# Altium project bluetooth_clock.PrjPcb
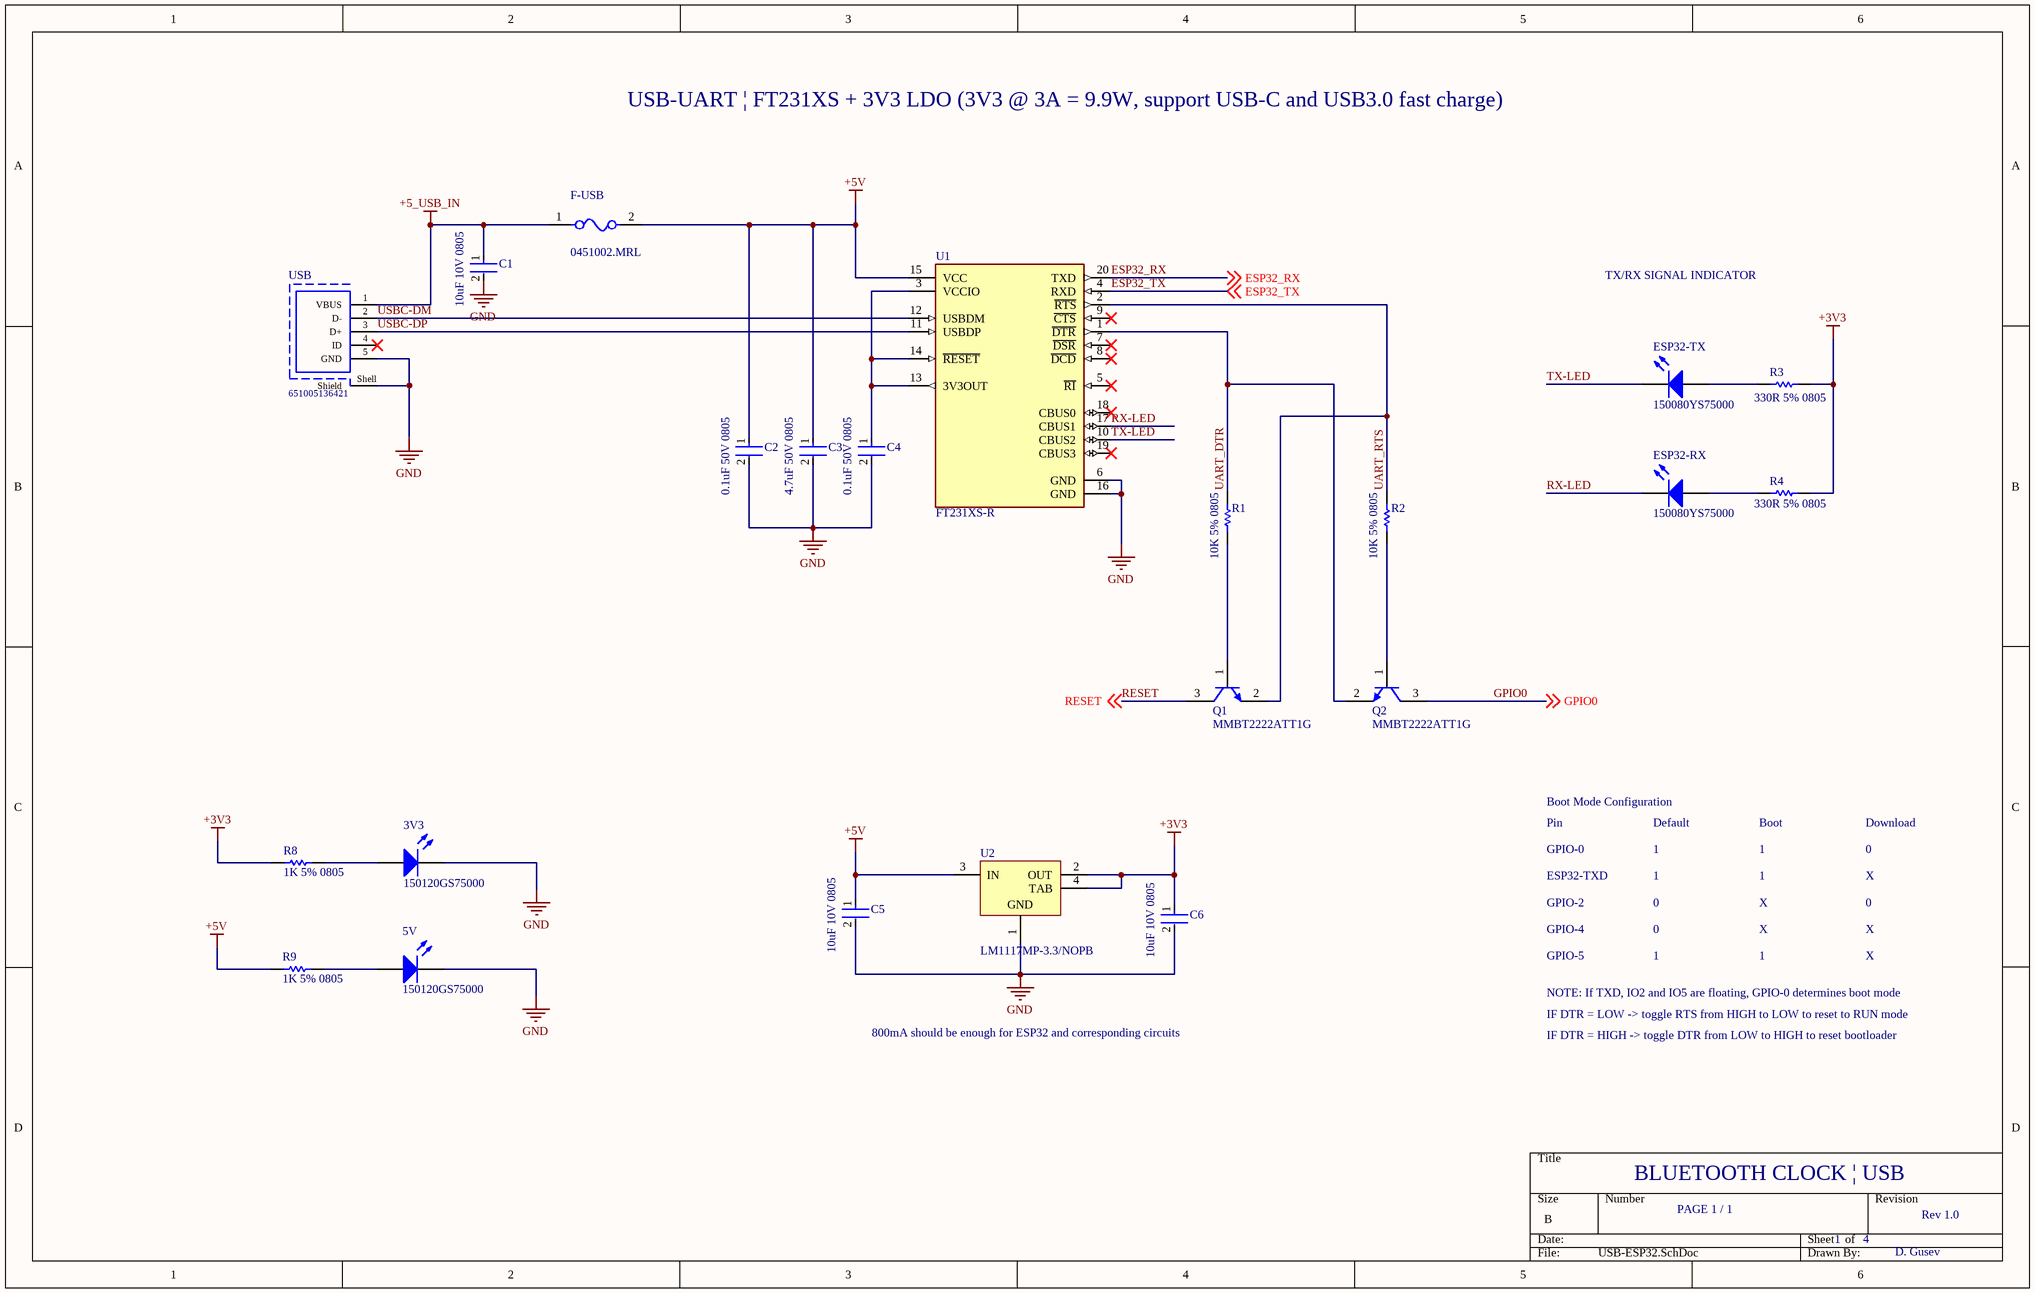
[diagram p0: USB-ESP32.SchDoc]
4 sheets, 56 parts. Net scope: global (net labels, ports and power ports of the same name join across sheets).
Board file: bluetooth_clock.PcbDoc
Sheets:
  USB-ESP32.SchDoc
  ESP32.SchDoc
  audio.SchDoc
  sd_card.SchDoc

## Sheet USB-ESP32.SchDoc
size B

### Parts
3V3  150120GS75000  [1206_A]
5V  150120GS75000  [1206_A]
C1  10uF 10V 0805  [FP-C0805C-DG-MFG]
C2  0.1uF 50V 0805  [FP-C0805C-DN-MFG]
C3  4.7uF 50V 0805  [FP-C2012-125-MFG]
C4  0.1uF 50V 0805  [FP-C0805C-DN-MFG]
C5  10uF 10V 0805  [FP-C0805C-DG-MFG]
C6  10uF 10V 0805  [FP-C0805C-DG-MFG]
ESP32-RX  150080YS75000  [0805_A]
ESP32-TX  150080YS75000  [0805_A]
F-USB  0451002.MRL  [FP-0451-MFG]
Q1  MMBT2222ATT1G  [ONSC-SC-75-3-463-01_V]
Q2  MMBT2222ATT1G  [ONSC-SC-75-3-463-01_V]
R1  10K 5% 0805  [RESC2013X60X40ML20T25]
R2  10K 5% 0805  [RESC2013X60X40ML20T25]
R3  330R 5% 0805  [RESC2013X60X40ML20T25]
R4  330R 5% 0805  [RESC2013X60X40ML20T25]
R8  1K 5% 0805  [RESC2013X60X40ML20T25]
R9  1K 5% 0805  [RESC2013X60X40ML20T25]
U1  FT231XS-R  [FP-SSOP-20-MFG]
U2  LM1117MP-3.3/NOPB  [DCY0004A_L]
USB  651005136421  [651005136421]

### Nets
+3V3: C6.1 R3.1 R4.1 R8.2 U2.2(OUT) U2.4(TAB)
+5_USB_IN: C1.1 F-USB.1 USB.1(VBUS)
+5V: C2.1 C3.1 C5.1 F-USB.2 R9.2 U1.15(VCC) U2.3(IN)
GND: 3V3.1(K) 5V.1(K) C1.2 C2.2 C3.2 C4.2 C5.2 C6.2 U1.6(GND) U1.16(GND) U2.1(GND) USB.5(GND) USB.Shell(Shield)
ESP32_RX: U1.20(TXD) ; off-sheet ESP32_RX
ESP32_TX: U1.4(RXD) ; off-sheet ESP32_TX
GPIO0: Q2.3(C) ; off-sheet GPIO0
RESET: Q1.3(C) ; off-sheet RESET
RX-LED: ESP32-RX.1(K) U1.17(CBUS1)
TX-LED: ESP32-TX.1(K) U1.10(CBUS2)
UART_DTR: Q2.2(E) R1.2 U1.1(~{DTR})
UART_RTS: Q1.2(E) R2.2 U1.2(~{RTS})
USBC-DM: U1.12(USBDM) USB.2(D-)
USBC-DP: U1.11(USBDP) USB.3(D+)
Net3V3_2: 3V3.2(A) R8.1
Net5V_2: 5V.2(A) R9.1
NetC4_1: C4.1 U1.3(VCCIO) U1.13(3V3OUT) U1.14(~{RESET})
NetESP32-RX_2: ESP32-RX.2(A) R4.2
NetESP32-TX_2: ESP32-TX.2(A) R3.2
NetQ1_1: Q1.1(B) R1.1
NetQ2_1: Q2.1(B) R2.1

Not connected (* = marked no-connect by the designer): U1 5(~{RI})* 7(~{DSR})* 8(~{DCD})* 9(~{CTS})* 18(CBUS0)* 19(CBUS3)*; USB 4(ID)*

### Notes on the sheet
- USB-UART | FT231XS + 3V3 LDO (3V3 @ 3A = 9.9W, support USB-C and USB3.0 fast charge)
- TX/RX SIGNAL INDICATOR
- Boot Mode Configuration
- Pin
- Default
- Boot
- Download
- GPIO-0
- ESP32-TXD
- GPIO-2
- 1
- 0
- X
- GPIO-4
- GPIO-5
- 800mA should be enough for ESP32 and corresponding circuits
- NOTE: If TXD, IO2 and IO5 are floating, GPIO-0 determines boot mode
- IF DTR = LOW -> toggle RTS from HIGH to LOW to reset to RUN mode
- IF DTR = HIGH -> toggle DTR from LOW to HIGH to reset bootloader
- BLUETOOTH CLOCK | USB
- PAGE 1 / 1
- 4
- Rev 1.0
- D. Gusev

### Library data of the parts
3V3 5V = CMP-1426-00014-1: SMD mono-color Chip LED, WL-SMCW, Green; Manufacturer: Wuerth Elektronik; PackageReference: 1206_A; PartNumber: 150120GS75000; ComponentLink1Description: Manufacturer URL; ComponentLink2URL: http://katalog.we-online.com/led/datasheet/150120GS75000.pdf; ComponentLink2Description: Datasheet; Color: Green; ComponentLink1URL: http://www.we-online.com
C1 C5 C6 = CMP-2007-03243-2: CAP CER 10UF 10V X5R 0805; Manufacturer Part Number: C0805C106K8PACTU; Manufacturer: Kemet; 3DS Part Number: 220-00001; Tolerance: 10%; Temperature Coefficient: 15%; Material: Ceramic; Device Class L2: Capacitors; Device Class L1: Passive Components; ComponentLink2URL: https://content.kemet.com/datasheets/KEM_C1006_X5R_SMD.pdf; Height: 1.4mm; Lead Free: Yes; Digikey Description: CAP CER 10UF 10V X5R 0805; Octopart: https://octopart.com/c0805c106k8pactu-kemet-98697; Capacitance: 10uF; Value: 10uF; Temperature Range Low: -55°C; Temperature: -55°C to +85°C; Automotive: No; Mouser Description: CAP CER 10UF 10V X5R 0805; Ipc Land Pattern Name: CAPC200125X125; Temperature Range High: +85°C; Voltage: 10V; RoHS: TRUE; Device Class L3: Ceramic Capacitors; ComponentLink2Description: Datasheet; Voltage Rating: 10V; Package: C0805C-DG; Temperature Characteristic: X5R; Category: Cap
C2 C4 = CMP-2007-00279-2: CAP CER 0.1UF 50V X7R 0805; Manufacturer Part Number: C0805C104K5RACTU; Manufacturer: KEMET; Value: 0.10 μF; Tolerance: 0.1; Temperature Coefficient: 30ppm/°C; Material: Ceramic; Device Class L2: Capacitors; Temperature Range Low: -55°C; Voltage Rating: 50 V; Digikey Description: CAP CER 0.1UF 50V X7R 0805; Category: Cap; ComponentLink2Description: Datasheet; Octopart: https://octopart.com/c0805c104k5ractu-kemet-143926; RoHS: TRUE; ComponentLink2URL: https://content.kemet.com/datasheets/KEM_C1003_C0G_SMD.pdf; Temperature Characteristic: X7R; Temperature: -55°C to +125°C; Height: 0.88mm; Temperature Range High: +125°C; Device Class L1: Passive Components; Automotive: No; Lead Free: Yes; Ipc Land Pattern Name: CAPC200125X78; Device Class L3: Ceramic Capacitors; Mouser Description: Cap Ceramic 0.1uF 50V X7R 10% SMD 2.0 x 1.2 mm 125 C Paper T/R; Capacitance: 0.10 μF; Package: C0805C-DN
C3 = CMP-08246-000007-1: CAP CER 4.7UF 50V X5R 0805; Manufacturer Part Number: C2012X5R1H475K125AB; Manufacturer: TDK Corporation; Tolerance: 10%; Temperature Coefficient: 15%; Material: Ceramic; Mouser Description: Multilayer Ceramic Capacitors MLCC - SMD/SMT 0805 4.7uF 50volts X5R 10%; Category: Cap; Temperature Range High: +85°C; Digikey Description: CAP CER 4.7UF 50V X5R 0805; Voltage Rating: 50V; Device Class L1: Passive Components; Temperature Range Low: -55°C; Lead Free: Yes; ComponentLink2Description: Datasheet; Capacitance: 4.7uF; Octopart: https://octopart.com/c2012x5r1h475k125ab-tdk-25947720; Device Class L2: Capacitors; Value: 4.7uF; Temperature: -55°C to +85°C; ComponentLink2URL: https://product.tdk.com/info/en/catalog/datasheets/mlcc_commercial_general_en.pdf; RoHS: TRUE; Height: 1.45mm; Temperature Characteristic: X5R; Package: C2012-125; Device Class L3: Ceramic Capacitors; Automotive: No
ESP32-RX ESP32-TX = CMP-1426-00012-1: SMD mono-color Chip LED, WL-SMCW, Yellow; Manufacturer: Wuerth Elektronik; Color: Yellow; ComponentLink1URL: http://www.we-online.com; PackageReference: 0805_A; ComponentLink2URL: http://katalog.we-online.com/led/datasheet/150080YS75000.pdf; ComponentLink1Description: Manufacturer URL; ComponentLink2Description: Datasheet; PartNumber: 150080YS75000
F-USB = CMP-08605-000053-1: FUSE BOARD MNT 2A 125VAC/VDC SMD; Manufacturer: Littelfuse; Max Fuse Dc Voltage: 125V; Value: 0.0367Ω; Fuse Interrupt Ac Current: 50A; Fuse I2T: 0.53A2Sec; Fuse Blow Speed: Fast; Device Class L2: Fuses; Temperature Range High: +125°C; Category: Fuse; ComponentLink2URL: https://www.littelfuse.com/~/media/electronics/datasheets/fuses/littelfuse_fuse_451_453_datasheet.pdf.pdf; Automotive: No; Temperature Range Low: -55°C; Voltage Rating: 125V; ComponentLink2Description: Datasheet; Temperature: -55°C to +125°C; Device Class L3: unset; Height: 2.94mm; Lead Free: Yes; Resistance: 0.0367Ω; Max Fuse Ac Voltage: 125V; Fuse Interrupt Dc Current: 50A; RoHS: TRUE; Fuse Current: 2A; Digikey Description: FUSE BOARD MNT 2A 125VAC/VDC SMD; Device Class L1: Circuit Protection; Octopart: https://octopart.com/0451002.mrl-littelfuse-566376; Mouser Description: Surface Mount Fuses 125V 2A; Package: 0451; Manufacturer Part Number: 0451002.MRL
Q1 Q2 = CMP-1048-00417-1: General Purpose Transistor, NPN Silicon, 3-Pin SC-75, Pb-Free, Tape and Reel; Manufacturer: On Semiconductor; IC Continuous (A): 0.6; fT Min (MHz): 300; DatasheetVersion: Rev. 5; PackageVersion: Rev. F, 07/2005; ComponentLink1Description: Manufacturer URL; RoHS: TRUE; Packing: Tape and Reel; ComponentLink3URL: http://www.onsemi.com/pub_link/Collateral/463-01.PDF; ComponentLink1URL: http://www.onsemi.com/; ComponentLink3Description: Package Specification; ComponentLink2URL: http://www.onsemi.cn/pub_link/Collateral/MMBT2222ATT1-D.PDF; Mounting Technology: Surface Mount; PartNumber: MMBT2222ATT1G; ComponentLink2Description: Datasheet; Polarity: NPN; PackageReference: SC-75-3-463-01; PackageDescription: 3-Pin Small Outline Transistor, Body 1.6 x 0.8 mm, Pitch 0.5 mm
R1-R4 R8 R9 = CMP-2001-00590-1: Part Number: ERA6AEB123V; Manufacturer: Panasonic
U1 = CMP-0248-00024-3: IC USB SERIAL FULL UART 20SSOP; Operating Supply Voltage: 5V; Operating Supply Current: 8mA; Number of Channels: 1; Min Supply Voltage: 2.97V; Max Supply Voltage: 5.5V; Data Rate: 12Mbps; Height: 0.059inch; Packaging: Tape and Reel; Mount: Surface Mount; Package Quantity: 2000; Radiation Hardening: No; Case/Package: SSOP; Min Operating Temperature: -40°C; Width: 0.157inch; Number of Pins: 20; Weight: 0.016oz; Interface: UART; Max Operating Temperature: 85°C; Length: 8.74mm
U2 = CMP-0062-01638-4: 800mA Low-Dropout Linear Regulator, 4-pin SOT-223, Pb-Free; Manufacturer: Texas Instruments; CompType: LDO IC; PackageTopMarking: XYTT*N05A; High-Reliability: Y; PowerWise: N; ComponentLink1URL: http://www.ti.com/general/docs/lit/getliterature.tsp?genericPartNumber=LM1117-N&fileType=pdf; PinCount: 4; PackageDescription: Molded SOT-223, 6.50 x 3.56 x 1.6mm Body, 4 Lead, 2.3mm Pitch; Code_IPC: SOT223-4; PartNumber: LM1117MP-3.3/NOPB; Code_JEDEC: TO-261-AA; RoHS: Y; PackageReference: DCY0004A; ComponentLink1Description: Datasheet URL
USB = CMP-1502-03248-1: Mini USB 2.0 Type B Receptacle WR-COM, Vertical, THT; Manufacturer: Wurth Elektronik; Rated Current: 1A; Working Voltage: 30VAC; Contact Resistance: 20mOhm; Gender: Receptacle; Part Number: 651005136421; Package Reference: 651005136421; Datasheet URL: https://katalog.we-online.de/em/datasheet/651005136421%282%29.pdf; Publisher: WurthElektronik; Operating Temperature: -40to105degC; Connector Type: MiniUSB2.0TypeB; Packaging: Tray; Mounting Technology: THT; Manufacturer URL: http://www.we-online.de; Orientation: Vertical

## Sheet ESP32.SchDoc
size B
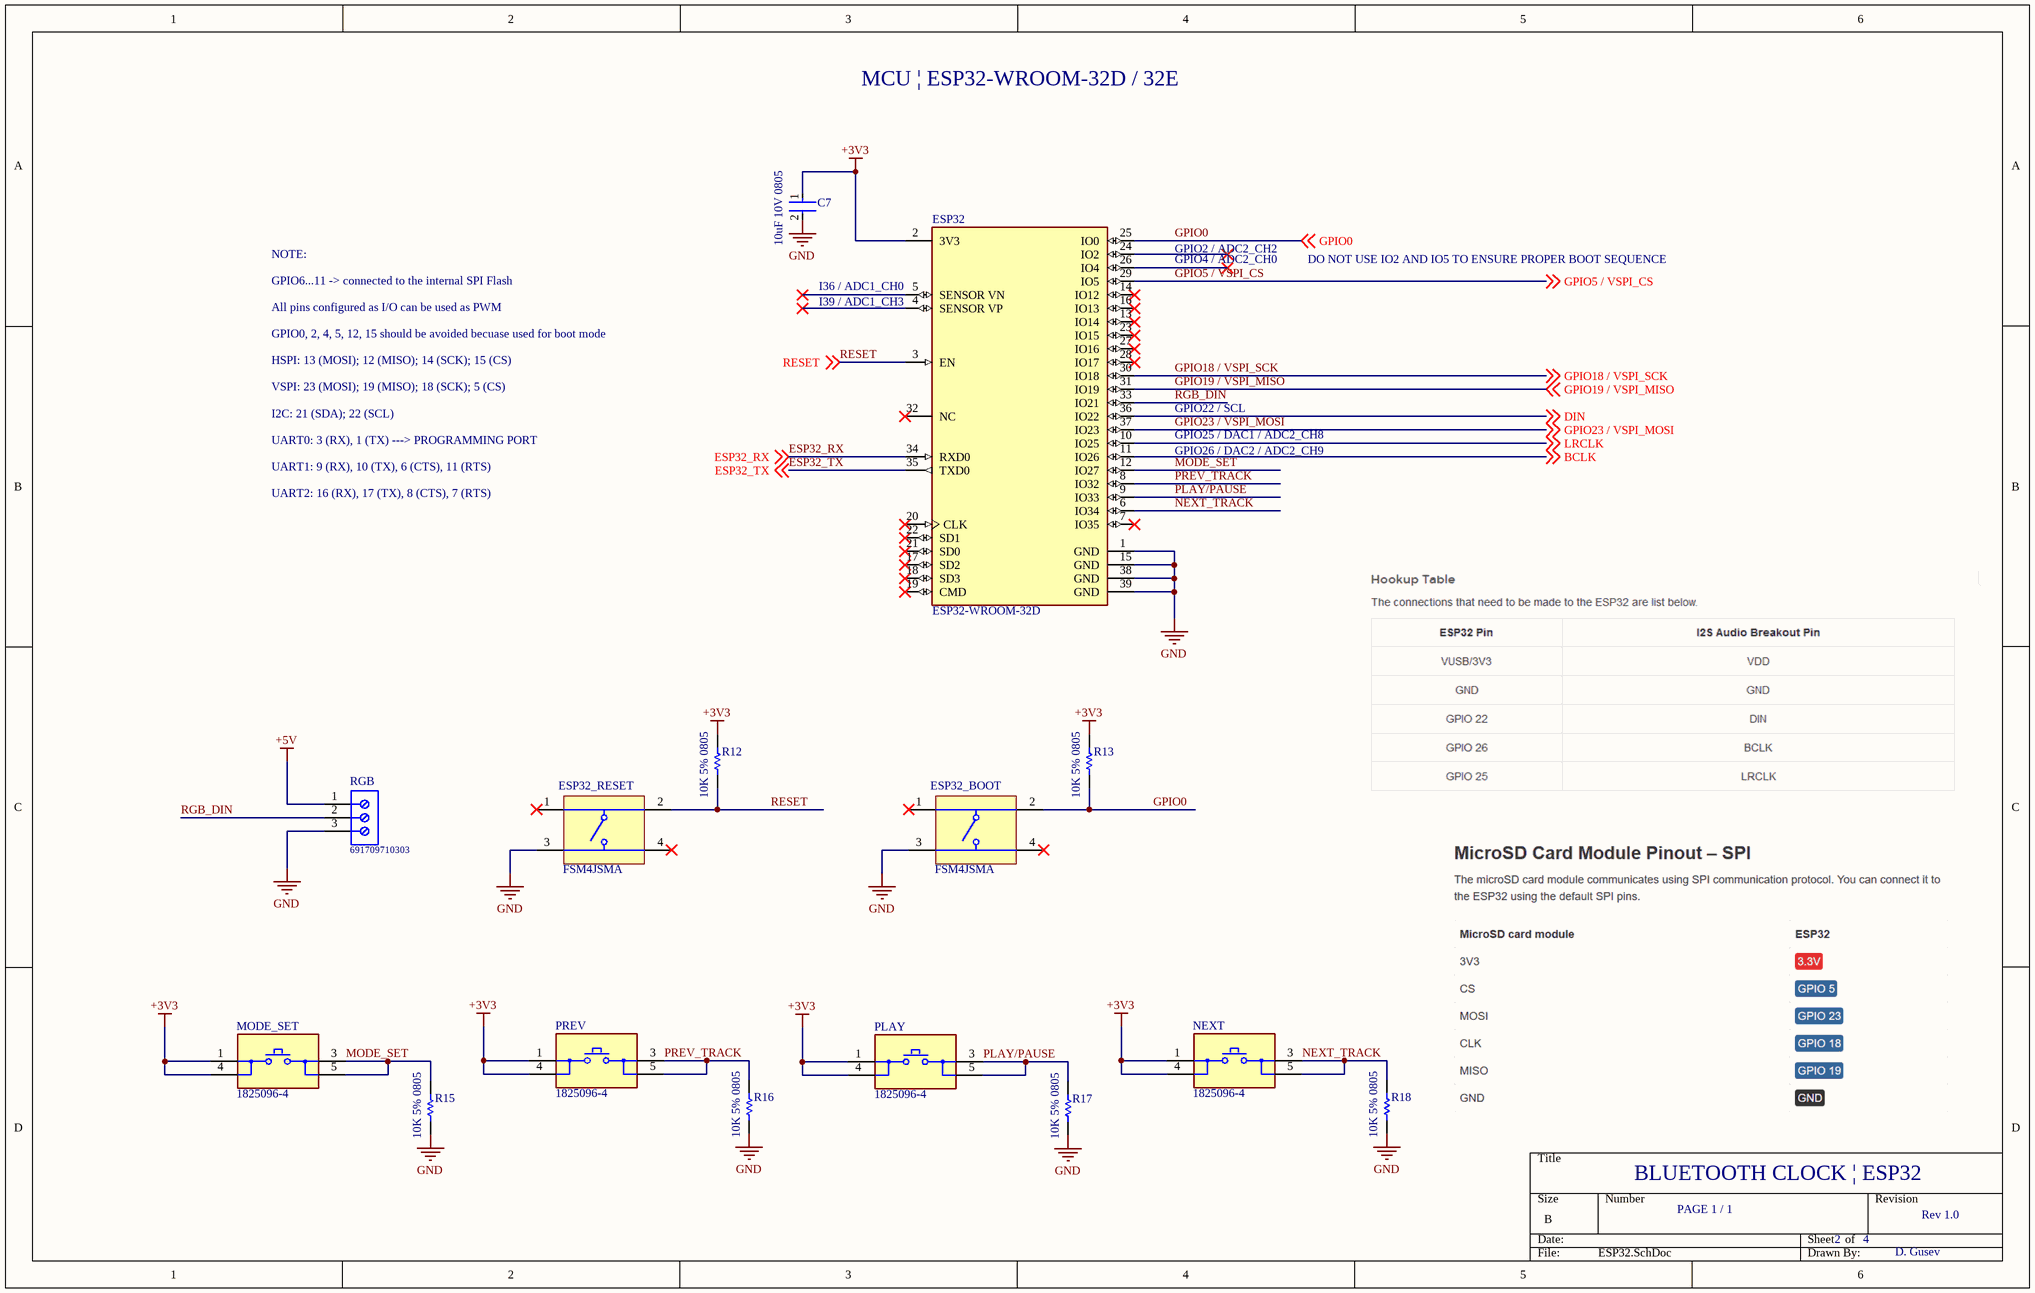
[diagram p1: ESP32.SchDoc]

### Parts
C7  10uF 10V 0805  [FP-C0805C-DG-MFG]
ESP32  ESP32-WROOM-32D  [FP-ESP32-WROOM-32D-MFG]
ESP32_BOOT  FSM4JSMA  [TECO-FSM4JSMA_V]
ESP32_RESET  FSM4JSMA  [TECO-FSM4JSMA_V]
MODE_SET  1825096-4  [FP-1825096-4-MFG]
NEXT  1825096-4  [FP-1825096-4-MFG]
PLAY  1825096-4  [FP-1825096-4-MFG]
PREV  1825096-4  [FP-1825096-4-MFG]
R12  10K 5% 0805  [RESC2013X60X40ML20T25]
R13  10K 5% 0805  [RESC2013X60X40ML20T25]
R15  10K 5% 0805  [RESC2013X60X40ML20T25]
R16  10K 5% 0805  [RESC2013X60X40ML20T25]
R17  10K 5% 0805  [RESC2013X60X40ML20T25]
R18  10K 5% 0805  [RESC2013X60X40ML20T25]
RGB  691709710303  [691709710303]

### Nets
+3V3: C7.1 ESP32.2(3V3) MODE_SET.1 MODE_SET.4 NEXT.1 NEXT.4 PLAY.1 PLAY.4 PREV.1 PREV.4 R12.2 R13.2
+5V: RGB.1
GND: C7.2 ESP32.1(GND) ESP32.15(GND) ESP32.38(GND) ESP32.39(GND) ESP32_BOOT.3 ESP32_RESET.3 R15.1 R16.1 R17.1 R18.1 RGB.3
BCLK: ESP32.11(IO26) ; off-sheet BCLK
DIN: ESP32.36(IO22) ; off-sheet DIN
ESP32_RX: ESP32.34(RXD0) ; off-sheet ESP32_RX
ESP32_TX: ESP32.35(TXD0) ; off-sheet ESP32_TX
GPIO0: ESP32.25(IO0) ESP32_BOOT.2 R13.1 ; off-sheet GPIO0
GPIO5 / VSPI_CS: ESP32.29(IO5) ; off-sheet GPIO5 / VSPI_CS
GPIO18 / VSPI_SCK: ESP32.30(IO18) ; off-sheet GPIO18 / VSPI_SCK
GPIO19 / VSPI_MISO: ESP32.31(IO19) ; off-sheet GPIO19 / VSPI_MISO
GPIO23 / VSPI_MOSI: ESP32.37(IO23) ; off-sheet GPIO23 / VSPI_MOSI
LRCLK: ESP32.10(IO25) ; off-sheet LRCLK
MODE_SET: ESP32.12(IO27) MODE_SET.3 MODE_SET.5 R15.2
NEXT_TRACK: ESP32.6(IO34) NEXT.3 NEXT.5 R18.2
PLAY/PAUSE: ESP32.9(IO33) PLAY.3 PLAY.5 R17.2
PREV_TRACK: ESP32.8(IO32) PREV.3 PREV.5 R16.2
RESET: ESP32.3(EN) ESP32_RESET.2 R12.1 ; off-sheet RESET
RGB_DIN: ESP32.33(IO21) RGB.2

Not connected (* = marked no-connect by the designer): ESP32 4(SENSOR_VP)* 5(SENSOR_VN)* 7(IO35)* 13(IO14)* 14(IO12)* 16(IO13)* 17(SD2)* 18(SD3)* 19(CMD)* 20(CLK)* 21(SD0)* 22(SD1)* 23(IO15)* 24(IO2)* 26(IO4)* 27(IO16)* 28(IO17)* 32(NC)*; ESP32_BOOT 1* 4*; ESP32_RESET 1* 4*

### Notes on the sheet
- MCU | ESP32-WROOM-32D / 32E
- NOTE:
- GPIO6...11 -> connected to the internal SPI Flash
- (near ESP32) I36 / ADC1_CH0
- GPIO2 / ADC2_CH2
- GPIO4 / ADC2_CH0
- DO NOT USE IO2 AND IO5 TO ENSURE PROPER BOOT SEQUENCE
- All pins configured as I/O can be used as PWM
- GPIO0, 2, 4, 5, 12, 15 should be avoided becuase used for boot mode
- HSPI: 13 (MOSI); 12 (MISO); 14 (SCK); 15 (CS)
- (near ESP32) I39 / ADC1_CH3
- VSPI: 23 (MOSI); 19 (MISO); 18 (SCK); 5 (CS)
- I2C: 21 (SDA); 22 (SCL)
- GPIO22 / SCL
- GPIO25 / DAC1 / ADC2_CH8
- UART0: 3 (RX), 1 (TX) ---> PROGRAMMING PORT
- UART1: 9 (RX), 10 (TX), 6 (CTS), 11 (RTS)
- UART2: 16 (RX), 17 (TX), 8 (CTS), 7 (RTS)
- GPIO26 / DAC2 / ADC2_CH9
- BLUETOOTH CLOCK | ESP32
- PAGE 1 / 1
- 2
- 4
- Rev 1.0
- D. Gusev

### Library data of the parts
C7 = CMP-2007-03243-2: as C1 on sheet USB-ESP32; Device Class L2: Capacitors; Device Class L1: Passive Components; ComponentLink2URL: https://content.kemet.com/datasheets/KEM_C1006_X5R_SMD.pdf; Height: 1.4mm; Lead Free: Yes; Digikey Description: CAP CER 10UF 10V X5R 0805; Octopart: https://octopart.com/c0805c106k8pactu-kemet-98697; Capacitance: 10uF; Value: 10uF; Temperature Range Low: -55°C; Temperature: -55°C to +85°C; Automotive: No; Mouser Description: CAP CER 10UF 10V X5R 0805; Ipc Land Pattern Name: CAPC200125X125; Temperature Range High: +85°C; Voltage: 10V; RoHS: TRUE; Device Class L3: Ceramic Capacitors; ComponentLink2Description: Datasheet; Voltage Rating: 10V; Package: C0805C-DG; Temperature Characteristic: X5R; Category: Cap
ESP32 = CMP-194065-000003-1: WIFI MODULE 32MBITS SPI FLASH; Manufacturer: Espressif Systems; Max Supply Voltage: 3.6V; Nominal Supply Current: 500mA; Max Frequency: 2484MHz; Number Of Adc Channels: 16; Number Of Gpio: 32; Interface: I2C,SPI,UART,Ethernet,I2S,Other; Data Rate: 150Mbits/s; Min Supply Voltage: 3V; Bandwidth: 72MHz; Sensitivity: -98dBm; Octopart: https://octopart.com/esp32-wroom-32d-espressif+systems-91040050; Package: ESP32-WROOM-32D; ComponentLink2URL: https://www.espressif.com/sites/default/files/documentation/esp32-wroom-32d_esp32-wroom-32u_datasheet_en.pdf; Lead Free: Yes; Category: UNK; Mouser Description: Wi-Fi/BT BLE Module ESP32-D0WD, SPI Flash, UART, P; Device Class L1: Integrated Circuits (ICs); RoHS: TRUE; Temperature Range Low: -40°C; ComponentLink2Description: Datasheet; Digikey Description: WIFI MODULE 32MBITS SPI FLASH; Height: 3.2mm; Temperature: -40°C to +85°C; Manufacturer Part Number: ESP32-WROOM-32D; Device Class L3: Transceivers; Device Class L2: RF Semiconductors and Devices; Temperature Range High: +85°C; Automotive: No
ESP32_BOOT ESP32_RESET = CMP-2000-05602-2: Swicth, SPST, 24 V, -35 to 85 degC, 4-Pin SMD, RoHS, Tape and Reel; Manufacturer: TE Connectivity; Switch Travel: 0.25mm; Mechanical Life: 100000Cycles; Contact Current Rating: 50mA; Operating Force: 1.57N; Actuator Material: Polyamide; Contact Resistance: 100mOhm; Voltage Rating: 24V; Illumination Type: Illuminated; Actuator Length: 0.055inch; Max Voltage Rating (DC): 12V; Case\/Package: SMD/SMT; Orientation: Straight; Datasheet URL: http://www.te.com/commerce/DocumentDelivery/DDEController?Action=showdoc&DocId=Customer+Drawing%7F2-1437565-7%7FV%7Fpdf%7FEnglish%7FENG_CD_2-1437565-7_V.pdf%7F4-1437565-2; Min Operating Temperature: -35degC; Packaging: LoosePiece; Termination: GullWing; Throw Configuration: SPST; Package Description: 4-Pin Surface Mount Device, Body 6 x 6 mm, Pitch 4.5 mm; Mounting Technology: SurfaceMount; Contact Plating: Silver; Datasheet Version: Rev. V, 02/2015; RoHSCompliant: true; Max Operating Temperature: 85degC; Length: 6mm; Voltage Rating (DC): 24V; Electrical Life: 100000Cycles; Current Rating: 50mA; Package Quantity: 750; Mount: SurfaceMount; Package Reference: FSM4JSMA; Manufacturer URL: http://www.te.com/; Width: 6mm; REACH SVHC: Unknown; Contact Material: CopperAlloy
MODE_SET NEXT PLAY PREV = CMP-03402-000007-1: SWITCH PUSH SPST-NO 0.4VA 20V; Switch Function: Off-Mom; Actuator Material: Thermoplastic; Operating Force: 3.92N; Throw Configuration: SPST; Contact Resistance: 20mR; Illumination Type: Illuminated; Contact Current Rating: 400mA; Actuator Color: Black; Electrical Life: 100000Cycles; Actuator Length: 3.84mm; Mount: Through Hole; Contact Plating: Gold; Max Voltage Rating (AC): 20V; Length: 8.13mm; Voltage Rating (AC): 20V; Series: TP, Alcoswitch; Orientation: Right Angle; Voltage Rating (DC): 20V; Max Voltage Rating (DC): 20V; RoHS Compliant: Yes; Termination: PC Pins; Min Operating Temperature: -30°C; Contact Material: Copper Alloy; Package Quantity: 25; Packaging: Bulk; Type: Switch; Depth: 12.9mm; Max Operating Temperature: 65°C; Illumination Color: Black
R12 R13 R15-R18 = CMP-2001-00590-1: as R1 on sheet USB-ESP32
RGB = CMP-1502-03336-1: Serie 7097 - 5.00 mm Horizontal Entry SMT with Pressure Clamp WR-TBL, 3 pin; Manufacturer: Wurth Elektronik; Pitch: 5.00mm; Pin Number: 3; Mounting Technology: SMT; Publisher: WurthElektronik; Package Reference: 691709710303; Packaging: TapeandReelwithCap; Part Number: 691709710303; Operating Temperature: -45to130degC; Datasheet URL: http://katalog.we-online.de/em/datasheet/6917097103xx.pdf; Manufacturer URL: http://www.we-online.de

## Sheet audio.SchDoc
size B
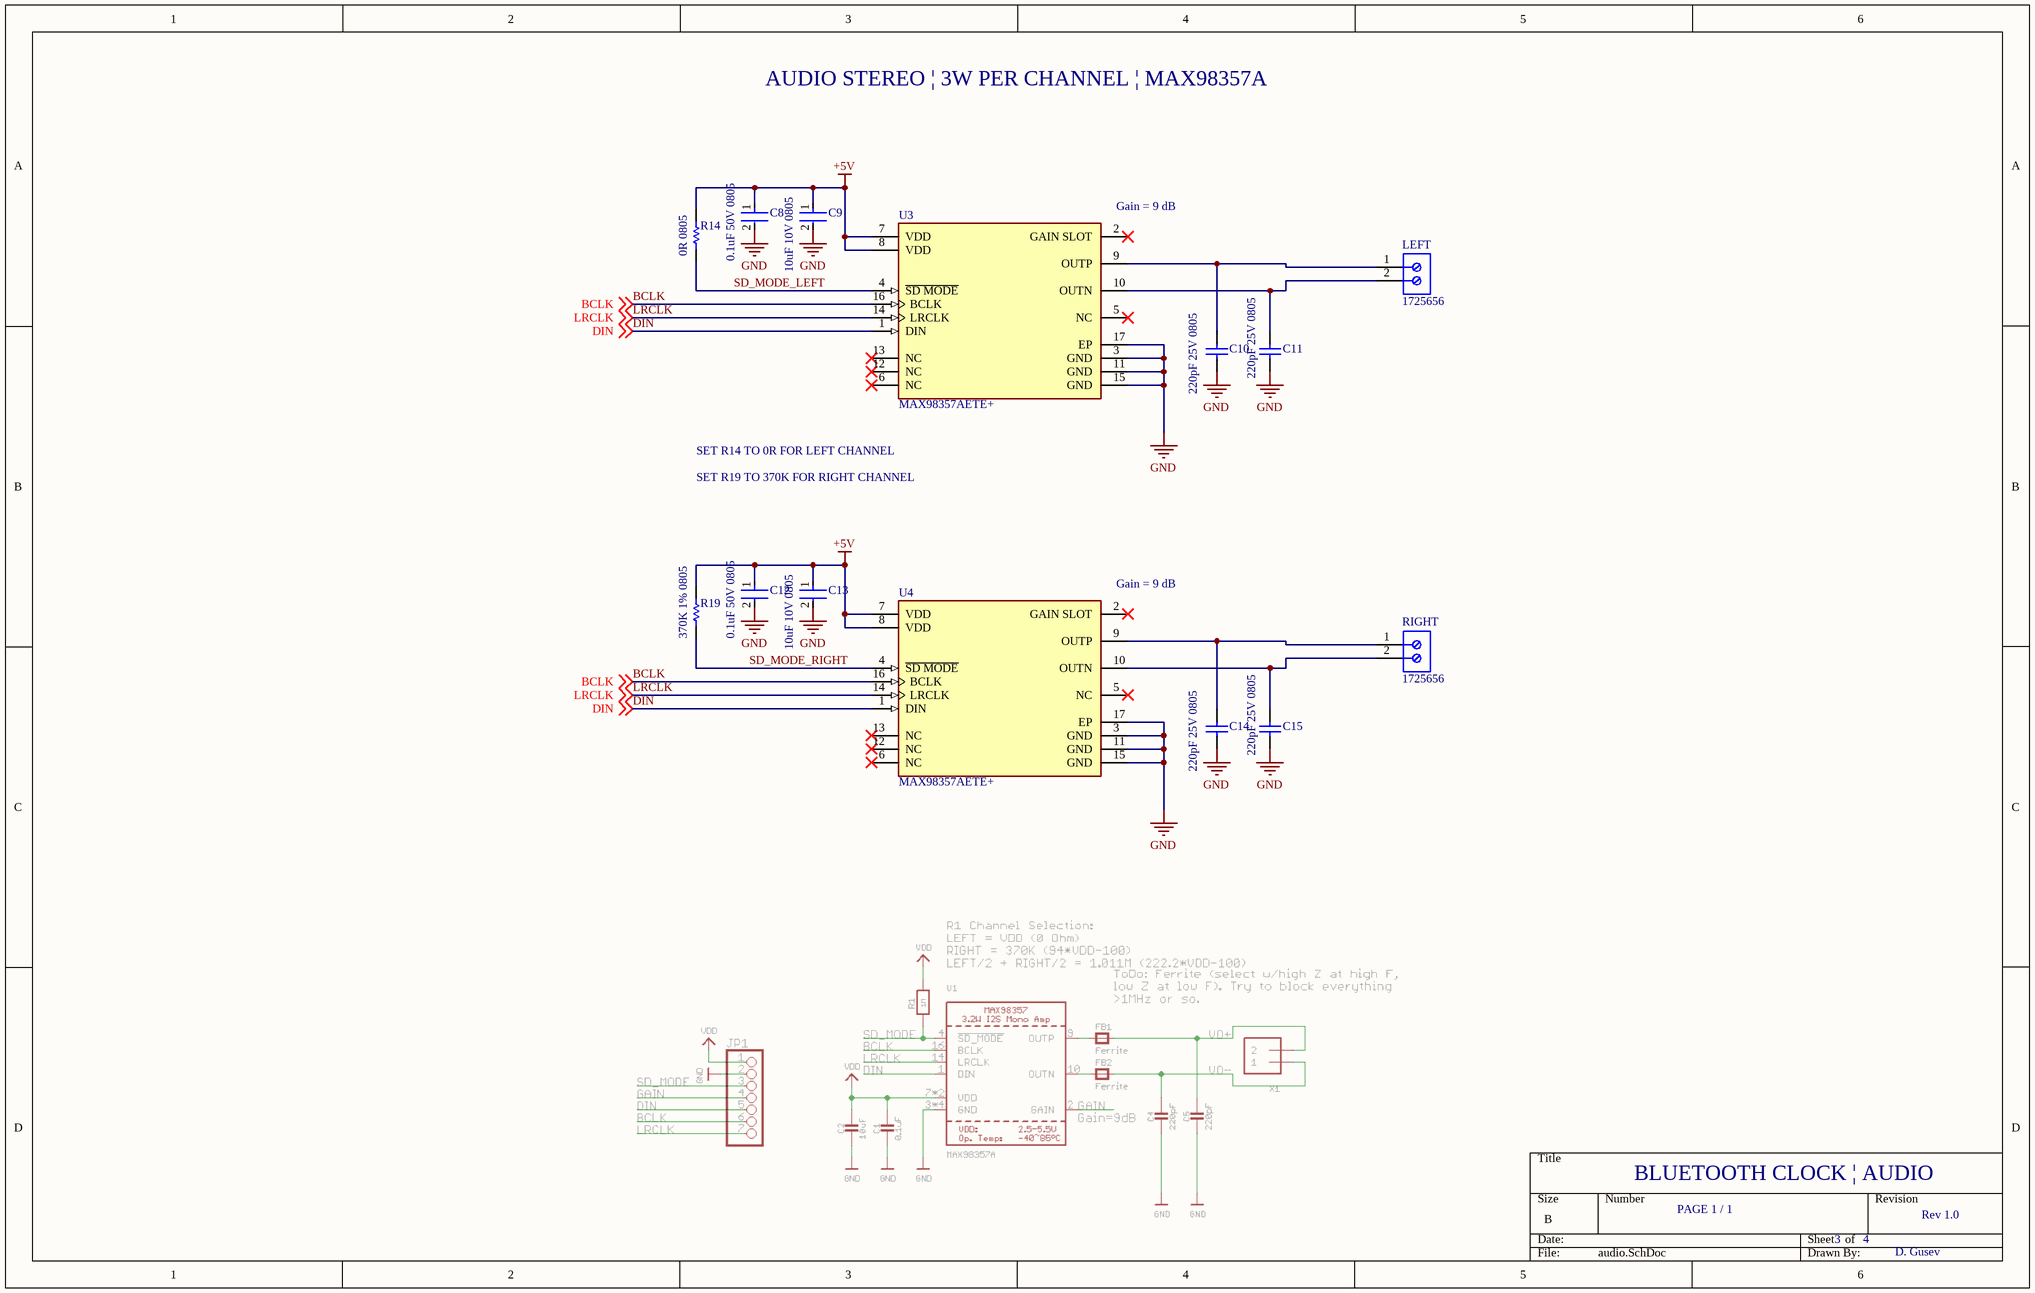
[diagram p2: audio.SchDoc]

### Parts
C8  0.1uF 50V 0805  [FP-C0805C-DN-MFG]
C9  10uF 10V 0805  [FP-C0805C-DG-MFG]
C10  220pF 25V 0805  [CAPC2013X94X50LL20T25]
C11  220pF 25V 0805  [CAPC2013X94X50LL20T25]
C12  0.1uF 50V 0805  [FP-C0805C-DN-MFG]
C13  10uF 10V 0805  [FP-C0805C-DG-MFG]
C14  220pF 25V 0805  [CAPC2013X94X50LL20T25]
C15  220pF 25V 0805  [CAPC2013X94X50LL20T25]
LEFT  1725656  [PHOE-1725656-2]
R14  0R 0805  [RESC2013X60X35NL10T20]
R19  370K 1% 0805  [RESC2013X60X35NL10T20]
RIGHT  1725656  [PHOE-1725656-2]
U3  MAX98357AETE+  [FP-T1633-4-MFG]
U4  MAX98357AETE+  [FP-T1633-4-MFG]

### Nets
+5V: C8.1 C9.1 C12.1 C13.1 R14.2 R19.2 U3.7(VDD) U3.8(VDD) U4.7(VDD) U4.8(VDD)
GND: C8.2 C9.2 C10.1 C11.1 C12.2 C13.2 C14.1 C15.1 U3.3(GND) U3.11(GND) U3.15(GND) U3.17(EP) U4.3(GND) U4.11(GND) U4.15(GND) U4.17(EP)
BCLK: U3.16(BCLK) U4.16(BCLK) ; off-sheet BCLK
DIN: U3.1(DIN) U4.1(DIN) ; off-sheet DIN
LRCLK: U3.14(LRCLK) U4.14(LRCLK) ; off-sheet LRCLK
SD_MODE_LEFT: R14.1 U3.4(~{SD_MODE})
SD_MODE_RIGHT: R19.1 U4.4(~{SD_MODE})
NetC10_2: C10.2 LEFT.1 U3.9(OUTP)
NetC11_2: C11.2 LEFT.2 U3.10(OUTN)
NetC14_2: C14.2 RIGHT.1 U4.9(OUTP)
NetC15_2: C15.2 RIGHT.2 U4.10(OUTN)

Not connected (* = marked no-connect by the designer): U3 2(GAIN_SLOT)* 5(NC)* 6(NC)* 12(NC)* 13(NC)*; U4 2(GAIN_SLOT)* 5(NC)* 6(NC)* 12(NC)* 13(NC)*

### Notes on the sheet
- AUDIO STEREO | 3W PER CHANNEL | MAX98357A
- (near U3) Gain = 9 dB
- SET R14 TO 0R FOR LEFT CHANNEL
- SET R19 TO 370K FOR RIGHT CHANNEL
- (near U4) Gain = 9 dB
- BLUETOOTH CLOCK | AUDIO
- PAGE 1 / 1
- 3
- 4
- Rev 1.0
- D. Gusev

### Library data of the parts
C8 C12 = CMP-2007-00279-2: as C2 on sheet USB-ESP32; Device Class L2: Capacitors; Temperature Range Low: -55°C; Voltage Rating: 50 V; Digikey Description: CAP CER 0.1UF 50V X7R 0805; Category: Cap; ComponentLink2Description: Datasheet; Octopart: https://octopart.com/c0805c104k5ractu-kemet-143926; RoHS: TRUE; ComponentLink2URL: https://content.kemet.com/datasheets/KEM_C1003_C0G_SMD.pdf; Temperature Characteristic: X7R; Temperature: -55°C to +125°C; Height: 0.88mm; Temperature Range High: +125°C; Device Class L1: Passive Components; Automotive: No; Lead Free: Yes; Ipc Land Pattern Name: CAPC200125X78; Device Class L3: Ceramic Capacitors; Mouser Description: Cap Ceramic 0.1uF 50V X7R 10% SMD 2.0 x 1.2 mm 125 C Paper T/R; Capacitance: 0.10 μF; Package: C0805C-DN
C9 C13 = CMP-2007-03243-2: as C1 on sheet USB-ESP32; Device Class L2: Capacitors; Device Class L1: Passive Components; ComponentLink2URL: https://content.kemet.com/datasheets/KEM_C1006_X5R_SMD.pdf; Height: 1.4mm; Lead Free: Yes; Digikey Description: CAP CER 10UF 10V X5R 0805; Octopart: https://octopart.com/c0805c106k8pactu-kemet-98697; Capacitance: 10uF; Value: 10uF; Temperature Range Low: -55°C; Temperature: -55°C to +85°C; Automotive: No; Mouser Description: CAP CER 10UF 10V X5R 0805; Ipc Land Pattern Name: CAPC200125X125; Temperature Range High: +85°C; Voltage: 10V; RoHS: TRUE; Device Class L3: Ceramic Capacitors; ComponentLink2Description: Datasheet; Voltage Rating: 10V; Package: C0805C-DG; Temperature Characteristic: X5R; Category: Cap
C10 C11 C14 C15 = CMP-2007-04219-1: Manufacturer: AVX Interconnect / Elco; Part Number: 08053A221JAT2A
LEFT RIGHT = CMP-2000-05299-1: Male Header, Pitch 2.54 mm, 1 x 2 Position, Height 9 mm, Tail Length 3.5 mm; Manufacturer: Phoenix Contact; Number of contacts: 2; Content: 250pc(s); Pitch: 2.54mm; Industrial packaging: Yes; Colour: Green; Manufacturer part No.: 1725656; Type: MPT0,5/2-2,54; Datasheet URL: http://datasheet.octopart.com/1725656-Phoenix-Contact-datasheet-5302866.pdf; Manufacturer URL: http://www.phoenixcontact.com/; Datasheet Version: Apr-08
R14 R19 = CMP-2001-01791-1: Part Number: RV0805FR-071ML; Manufacturer: Yageo
U3 U4 = CMP-05698-000004-1: IC AMP CLASS D MONO 3.2W 16TQFN; Supply Type: Single; Load Impedance: 4R; Power Supply Rejection Ratio (PSRR): 77dB; Gain: 15dB; Max Supply Voltage: 5.5V; Operating Supply Voltage: 5V; Max Power Dissipation: 1.666W; Max Output Current: 1.6A; Min Supply Voltage: 2.5V; Operating Supply Current: 2.75mA; Number of Channels: 1; Max Operating Temperature: 85°C; Number of Pins: 16; Mount: Surface Mount; Package Quantity: 490; Packaging: Rail/Tube; Min Operating Temperature: -40°C; Voltage Gain: 15dB; Max Output Power: 3.2W; Output Power: 3.2W; Contact Plating: Tin; Radiation Hardening: No

## Sheet sd_card.SchDoc
size B
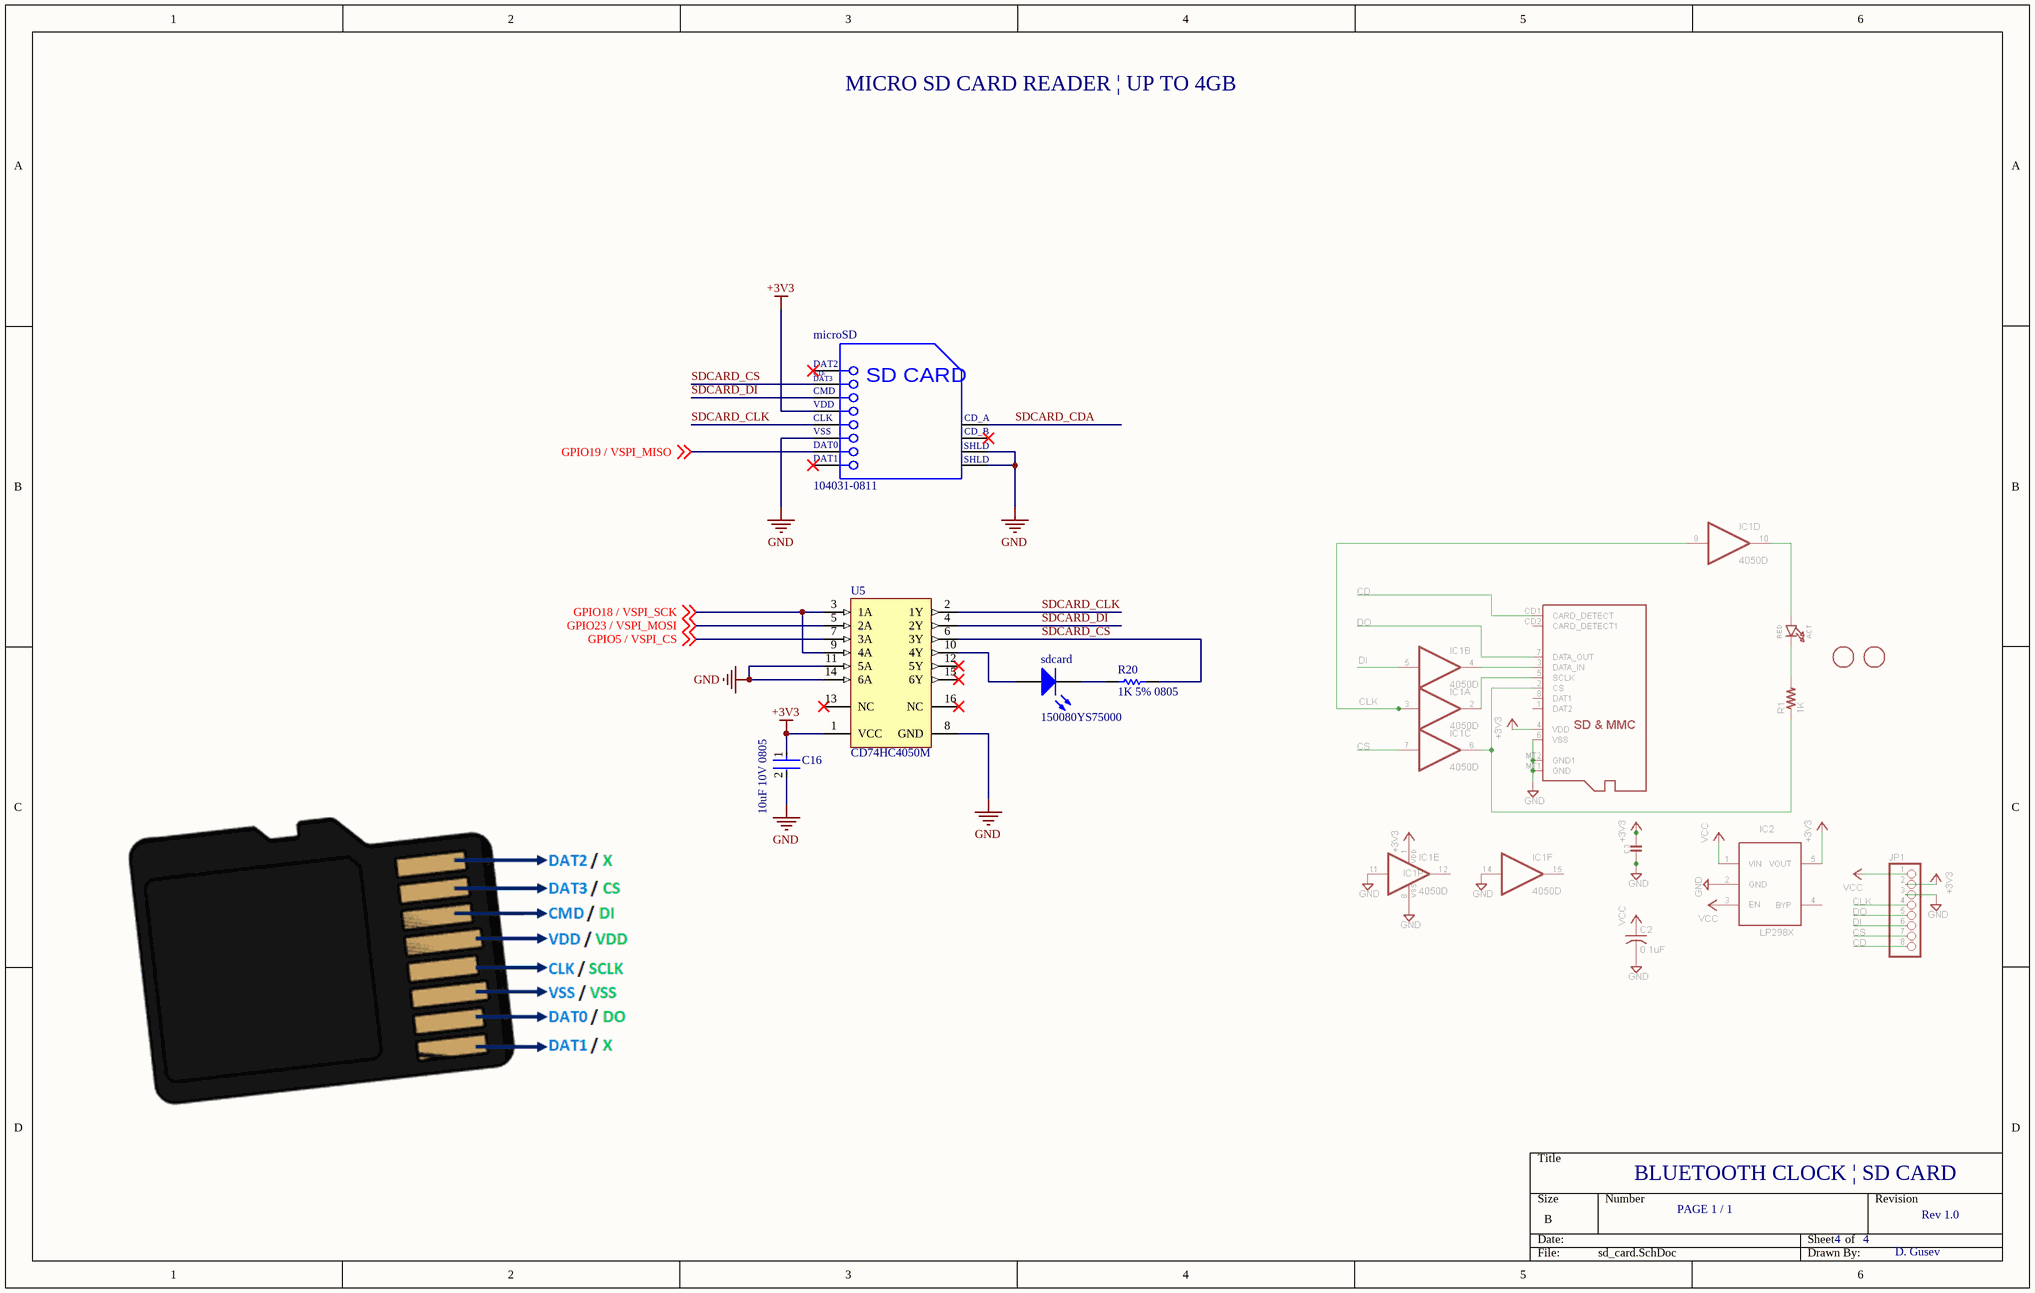
[diagram p3: sd_card.SchDoc]

### Parts
C16  10uF 10V 0805  [FP-C0805C-DG-MFG]
microSD  104031-0811  [MOLX-104031-0811_V]
R20  1K 5% 0805  [RESC2013X60X40ML20T25]
sdcard  150080YS75000  [0805_A]
U5  CD74HC4050M  [D0016A_M]

### Nets
+3V3: C16.1 microSD.4(VDD) U5.1(VCC)
GND: C16.2 microSD.6(VSS2) microSD.11(SHLD1) microSD.12(SHLD2) U5.8(GND) U5.11(5A) U5.14(6A)
GPIO5 / VSPI_CS: U5.7(3A) ; off-sheet GPIO5 / VSPI_CS
GPIO18 / VSPI_SCK: U5.3(1A) U5.9(4A) ; off-sheet GPIO18 / VSPI_SCK
GPIO19 / VSPI_MISO: microSD.7(DAT0) ; off-sheet GPIO19 / VSPI_MISO
GPIO23 / VSPI_MOSI: U5.5(2A) ; off-sheet GPIO23 / VSPI_MOSI
SDCARD_CDA: microSD.9(CD_A)
SDCARD_CLK: microSD.5(CLK) U5.2(1Y)
SDCARD_CS: microSD.2(CMD) R20.2 U5.6(3Y)
SDCARD_DI: microSD.3(VSS1) U5.4(2Y)
NetR20_1: R20.1 sdcard.1(K)
Netsdcard_2: sdcard.2(A) U5.10(4Y)

Not connected (* = marked no-connect by the designer): microSD 1(CD/DAT3)* 8(DAT1)* 10(CD_B)*; U5 12(5Y)* 13(NC)* 15(6Y)* 16(NC)*

### Notes on the sheet
- MICRO SD CARD READER | UP TO 4GB
- BLUETOOTH CLOCK | SD CARD
- PAGE 1 / 1
- 4
- Rev 1.0
- D. Gusev
- (in symbol CMP-2000-05825-1) DAT2; CD/; DAT3; SD CARD; VSS; SHLD

### Library data of the parts
C16 = CMP-2007-03243-2: as C1 on sheet USB-ESP32; Device Class L2: Capacitors; Device Class L1: Passive Components; ComponentLink2URL: https://content.kemet.com/datasheets/KEM_C1006_X5R_SMD.pdf; Height: 1.4mm; Lead Free: Yes; Digikey Description: CAP CER 10UF 10V X5R 0805; Octopart: https://octopart.com/c0805c106k8pactu-kemet-98697; Capacitance: 10uF; Value: 10uF; Temperature Range Low: -55°C; Temperature: -55°C to +85°C; Automotive: No; Mouser Description: CAP CER 10UF 10V X5R 0805; Ipc Land Pattern Name: CAPC200125X125; Temperature Range High: +85°C; Voltage: 10V; RoHS: TRUE; Device Class L3: Ceramic Capacitors; ComponentLink2Description: Datasheet; Voltage Rating: 10V; Package: C0805C-DG; Temperature Characteristic: X5R; Category: Cap
microSD = CMP-2000-05825-1: Micro SD Card, RA, -25 to 85 degC, 8-Pin SMD, RoHS, Tape and Reel; Voltage Rating: 10VAC/DC; Number of Contacts: 8; Insertion - Extraction Style: Push-Pull; Pitch: 1.1mm; Mating Cycles: 10000; Brand: Molex; Current Rating: 500mA; Manufacturer URL: http://www.molex.com/; Card Type: microSD; Mounting Type: Standard; Height: 1.42mm; Mounting Technology: SurfaceMount; Contact Plating: Gold; Product Category: MemoryCardConnectors; Package Description: 8-Pin Surface Mount Device, Body 11.95 x 11.4 mm, Pitch 1.1 mm; Datasheet URL: http://www.molex.com/pdm_docs/sd/1040310811_sd.pdf; Termination Style: SMD; Length: 11.4mm; Housing Material: LiquidCrystalPolymer(LCP); Orientation: RightAngle; RoHS: True; Contact Material: PhosphorBronze; Datasheet Version: Rev. E, 04/2006; Packaging: Reel; Manufacturer: Molex; Series: 104031; Product: CardConnectors; Number of Rows: 1Row; Package Reference: 104031-0811
R20 = CMP-2001-00590-1: as R1 on sheet USB-ESP32
sdcard = CMP-1426-00012-1: as ESP32-RX on sheet USB-ESP32; Color: Yellow; ComponentLink1URL: http://www.we-online.com; PackageReference: 0805_A; ComponentLink2URL: http://katalog.we-online.com/led/datasheet/150080YS75000.pdf; ComponentLink1Description: Manufacturer URL; ComponentLink2Description: Datasheet; PartNumber: 150080YS75000
U5 = CMP-0440-00356-3: High Speed CMOS Logic Hex Non-Inverting Buffers, D0016A, TUBE; Manufacturer: Texas Instruments; F @ Nom Voltage(Max)(Mhz): 28; Voltage(Nom)(V): 6; VCC(Min)(V): 2; tpd @ Nom Voltage(Max)(ns): 18; ICC @ Nom Voltage(Max)(mA): 0.02; Rating: Catalog; PackageReference: D0016A; DatasheetVersion: SCHS205I; Output Type: CMOS; Operating Temperature Range(C): -55 to 125; Bits(#): 6; VCC(Max)(V): 6; PackageVersion: http://www.ti.com/lit/ml/mpds178g/mpds178g.pdf; Input Type: CMOS; Generic Part Number: CD74HC4050; Code_JEDEC: MS-012 variation AC

## Nets that join several sheets
+3V3: USB-ESP32 (6 pins), ESP32 (12 pins), sd_card (C16.1 microSD.4 U5.1)
+5V: USB-ESP32 (7 pins), ESP32 (RGB.1), audio (10 pins)
GND: USB-ESP32 (13 pins), ESP32 (12 pins), audio (16 pins), sd_card (7 pins)
BCLK: ESP32 (ESP32.11), audio (U3.16 U4.16)
DIN: ESP32 (ESP32.36), audio (U3.1 U4.1)
ESP32_RX: USB-ESP32 (U1.20), ESP32 (ESP32.34)
ESP32_TX: USB-ESP32 (U1.4), ESP32 (ESP32.35)
GPIO0: USB-ESP32 (Q2.3), ESP32 (ESP32.25 ESP32_BOOT.2 R13.1)
GPIO5 / VSPI_CS: ESP32 (ESP32.29), sd_card (U5.7)
GPIO18 / VSPI_SCK: ESP32 (ESP32.30), sd_card (U5.3 U5.9)
GPIO19 / VSPI_MISO: ESP32 (ESP32.31), sd_card (microSD.7)
GPIO23 / VSPI_MOSI: ESP32 (ESP32.37), sd_card (U5.5)
LRCLK: ESP32 (ESP32.10), audio (U3.14 U4.14)
RESET: USB-ESP32 (Q1.3), ESP32 (ESP32.3 ESP32_RESET.2 R12.1)